# Altium project Final_Thesis.PrjPcb
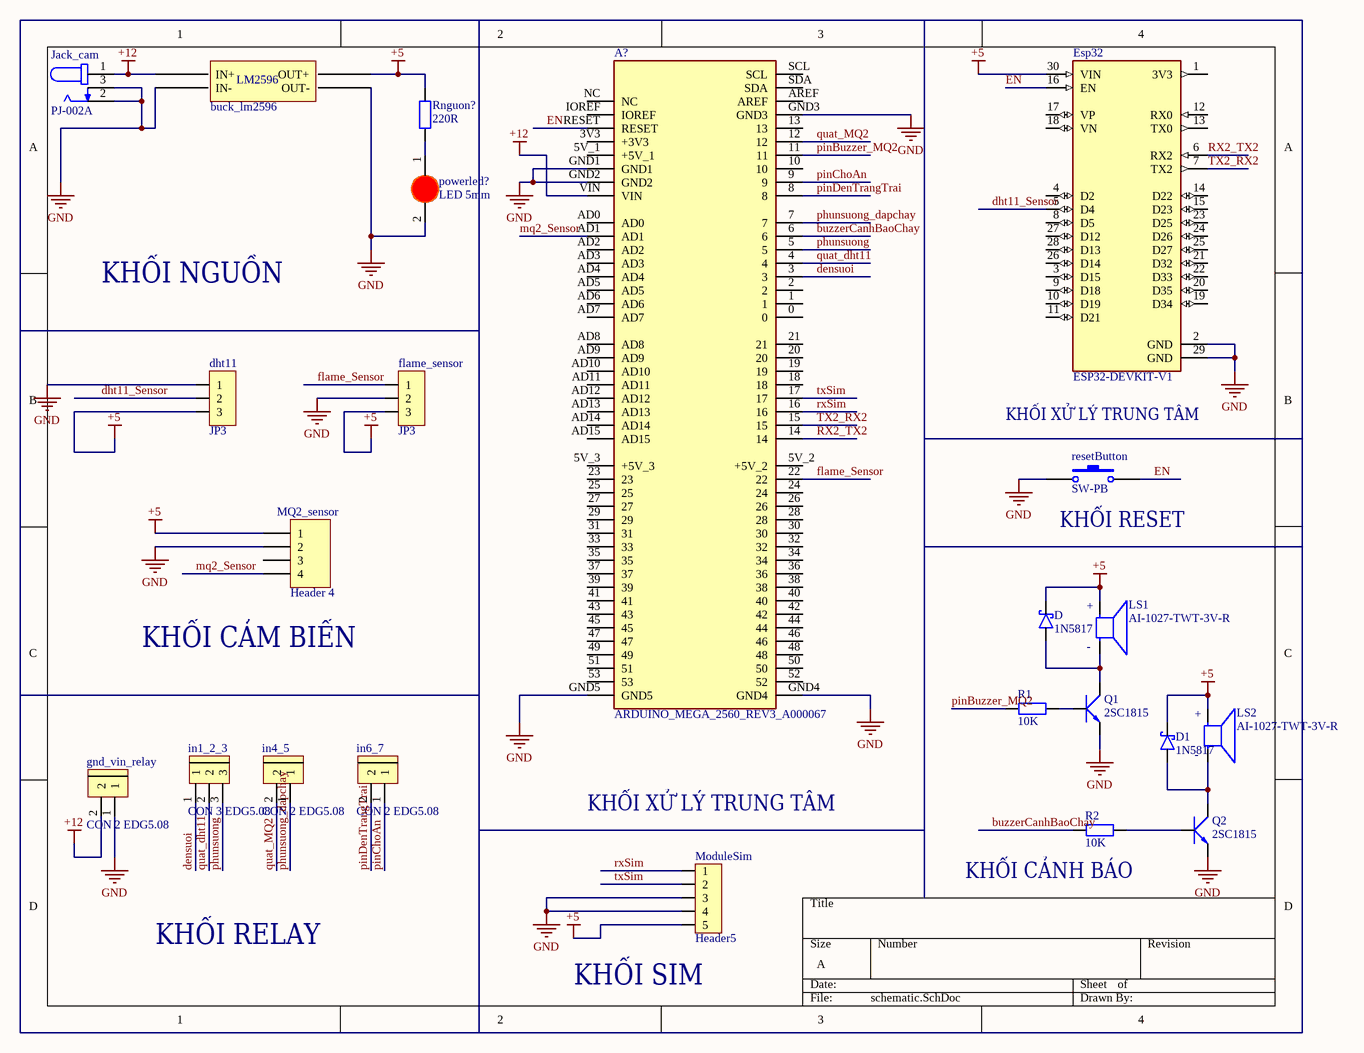
[diagram p0: schematic.SchDoc]
1 sheet, 23 parts. Net scope: global (net labels, ports and power ports of the same name join across sheets).
Board file: PCB_main.PcbDoc

## Sheet schematic.SchDoc
size A; SheetNumber: 1; SheetTotal: 1

### Parts
A?  ARDUINO_MEGA_2560_REV3_A000067  [ARDUINO_ARDUINO_MEGA_2560_REV3_A000067]
buck_lm2596  BUCK_LM2596  [BUCK_LM2596]  (value not drawn)
D  1N5817  [DO41-1]
D1  1N5817  [DO41-1]
dht11  JP3  [JP3-C1T]
Esp32  ESP32-DEVKIT-V1  [MODULE_ESP32_DEVKIT_V1]
flame_sensor  JP3  [JP3-C1T]
gnd_vin_relay  CON 2 EDG5.08  [CON 2 2EDG5.08]
in1_2_3  CON 3 EDG5.08  [CON 3 3EDG5.08]
in4_5  CON 2 EDG5.08  [CON 2 2EDG5.08]
in6_7  CON 2 EDG5.08  [CON 2 2EDG5.08]
Jack_cam  PJ-002A  [CUI_PJ-002A]
LS1  AI-1027-TWT-3V-R  [XDCR_AI-1027-TWT-3V-R]
LS2  AI-1027-TWT-3V-R  [XDCR_AI-1027-TWT-3V-R]
ModuleSim  Header5  [HDR5]
MQ2_sensor  Header 4  [HDR1X4]
powerled?  LED 5mm  [LED-5MM-RED]
Q1  2SC1815  [TO92-123]
Q2  2SC1815  [TO92-123]
R1  10K  [tro vach 1/4w]
R2  10K  [tro vach 1/4w]
resetButton  SW-PB  [SPST-2]
Rnguon?  220R  [tro vach 1/4w]

### Nets
+5: buck_lm2596.4(OUT+) D.C D1.C dht11.3 Esp32.30(VIN) flame_sensor.3 LS1.P LS2.P ModuleSim.5 MQ2_sensor.1 Rnguon?.2
+12: A?.VIN buck_lm2596.1(IN+) gnd_vin_relay.2 Jack_cam.1
GND: A?.GND1 A?.GND2 A?.GND3 A?.GND4 A?.GND5 buck_lm2596.2(IN-) buck_lm2596.3(OUT-) dht11.1 Esp32.2(GND) Esp32.29(GND) flame_sensor.2 gnd_vin_relay.1 Jack_cam.2 Jack_cam.3 ModuleSim.3 ModuleSim.4 MQ2_sensor.2 powerled?.2(K) Q1.1(E) Q2.1(E) resetButton.1
buzzerCanhBaoChay: A?.6 R2.1
densuoi: A?.3 in1_2_3.1
dht11_Sensor: dht11.2 Esp32.5(D4)
EN: A?.RESET Esp32.16(EN) resetButton.2
flame_Sensor: A?.22 flame_sensor.1
mq2_Sensor: A?.AD1 MQ2_sensor.4
phunsuong: A?.5 in1_2_3.3
phunsuong_dapchay: A?.7 in4_5.1
pinBuzzer_MQ2: A?.11 R1.1
pinChoAn: A?.9 in6_7.1
pinDenTrangTrai: A?.8 in6_7.2
quat_dht11: A?.4 in1_2_3.2
quat_MQ2: A?.12 in4_5.2
RX2_TX2: A?.14 Esp32.6(RX2)
rxSim: A?.16 ModuleSim.1
TX2_RX2: A?.15 Esp32.7(TX2)
txSim: A?.17 ModuleSim.2
NetD1_A: D1.A LS2.N Q2.2(C)
NetD_A: D.A LS1.N Q1.2(C)
Netpowerled?_1: powerled?.1(A) Rnguon?.1
NetQ1_3: Q1.3(B) R1.2
NetQ2_3: Q2.3(B) R2.2

Not connected (* = marked no-connect by the designer): A? 0 1 2 3V3(+3V3) 5V_1(+5V_1) 5V_2(+5V_2) 5V_3(+5V_3) 10 13 18 19 20 21 23 24 25 26 27 28 29 30 31 32 33 34 35 36 37 38 39 40 41 42 43 44 45 46 47 48 49 50 51 52 53 AD0 AD2 AD3 AD4 AD5 AD6 AD7 AD8 AD9 AD10 AD11 AD12 AD13 AD14 AD15 AREF IOREF NC SCL SDA; Esp32 1(3V3) 3(D15) 4(D2) 8(D5) 9(D18) 10(D19) 11(D21) 12(RX0) 13(TX0) 14(D22) 15(D23) 17(VP) 18(VN) 19(D34) 20(D35) 21(D32) 22(D33) 23(D25) 24(D26) 25(D27) 26(D14) 27(D12) 28(D13); MQ2_sensor 3

### Notes on the sheet
- KHỐI NGUỒN
- KHỐI XỬ LÝ TRUNG TÂM
- (near resetButton) KHỐI RESET
- (near MQ2_sensor) KHỐI CẢM BIẾN
- (near R2) KHỐI CẢNH BÁO
- KHỐI RELAY
- (near ModuleSim) KHỐI SIM
- (in symbol AI-1027-TWT-3V-R) +; -
- (in symbol BUCK_LM2596) LM2596

### Library data of the parts
A? = ARDUINO_MEGA_2560_REV3_A000067: ATmega2560 Arduino Mega2560 AVR® ATmega AVR MCU 8-Bit Embedded Evaluation Board; MP: ARDUINO MEGA 2560 REV3 | A000067; SnapEDA_Link: https://www.snapeda.com/parts/ARDUINO%20MEGA%202560%20REV3%20%7C%20A000067/Arduino/view-part/?ref=snap; Package: Non-Standard Arduino; Value: *; MF: Arduino; Check_prices: https://www.snapeda.com/parts/ARDUINO%20MEGA%202560%20REV3%20%7C%20A000067/Arduino/view-part/?ref=eda
D D1 = 1N5817: 5A SCHOTTKY RECTIFIER; MF: STMicroelectronics; Value: *; SnapEDA_Link: https://www.snapeda.com/parts/1N5817/STMicroelectronics/view-part/2770372/?ref=snap; Price: None; Availability: Unavailable; Package: DO-41 STMicroelectronics; MP: 1N5817
dht11 flame_sensor = JP3: WR-PHD 2.54 mm Angled Socket Header; Manufacturer: W¨¹rth Elektronik eiSos GmbH; partNo: 613003143121; ComponentLink1 Description: Manufacturer; ComponentLink2 Description: Datasheet; NoPins: 03; Created Date: 29 March 2013; ComponentLink1URL: http://www.we-online.com; ComponentLink2URL: http://katalog.we-online.de/em/datasheet/6130xx143121.pdf; Created by: Karrer Zheng
Esp32 = ESP32-DEVKIT-V1: Dual core, Wi-Fi: 2.4 GHz up to 150 Mbits/s,BLE (Bluetooth Low Energy) and legacy Bluetooth, 32 bits, Up to 240 MHz; MF: Do it; Price: None; Availability: Not in stock; Package: None; MP: ESP32-DEVKIT-V1; Value: *; SnapEDA_Link: https://www.snapeda.com/parts/ESP32-DEVKIT-V1/Do+it/view-part/?ref=snap; Check_prices: https://www.snapeda.com/parts/ESP32-DEVKIT-V1/Do+it/view-part/?ref=eda
gnd_vin_relay in4_5 in6_7 = CON 2 EDG5.08: Cắm; Ten_Linh_Kien: CON 2 2EDG5.08-2P 5.08MM ( Xanh Cong); Ma_Hang: MH000759; Ghi_Chu: *; Don_Vi: Con; Kieu_Chan: *; Chung_Loai: Cắm
in1_2_3 = CON 3 EDG5.08: Cắm; Ten_Linh_Kien: CON 3 2EDG5.08-3P 5.08MM ( Xanh Cong); Ma_Hang: MH000760; Ghi_Chu: *; Kieu_Chan: *; Don_Vi: Con; Chung_Loai: Cắm
Jack_cam = PJ-002A: 2.0 x 6.5 mm, 2.5 A, Horizontal, Through Hole, Dc Power Jack Connector; MF: CUI Devices; MP: PJ-002A; Check_prices: https://www.snapeda.com/parts/PJ-002A/CUI+Devices/view-part/?ref=eda; Availability: In Stock; CUI_purchase_URL: https://www.cuidevices.com/product/interconnect/connectors/dc-power-connectors/jacks/pj-002a?utm_source=snapeda.com&utm_medium=referral&utm_campaign=snapedaBOM; SnapEDA_Link: https://www.snapeda.com/parts/PJ-002A/CUI+Devices/view-part/?ref=snap; Purchase-URL: https://pricing.snapeda.com/search/part/PJ-002A/?ref=eda; Price: None; Package: None; Value: *
LS1 LS2 = AI-1027-TWT-3V-R: AUDIO INDICATOR 3VDC 30MA 80DBA 2700HZ; MF: PUI Audio; SnapEDA_Link: https://www.snapeda.com/parts/AI-1027-TWT-3V-R/PUI+Audio%252C+Inc./view-part/?ref=snap; Package: None; Value: *; MP: AI-1027-TWT-3V-R; Check_prices: https://www.snapeda.com/parts/AI-1027-TWT-3V-R/PUI+Audio%252C+Inc./view-part/?ref=eda
ModuleSim = Header5: Header IDC, 5 x 1 Pin Vertical 2.54mm Pitch (Non-Boxed, Male); Manufacturer: W¨¹rth Elektronik eiSos GmbH; partNo: 613002143121; ComponentLink1 Description: Manufacturer; ComponentLink2 Description: Datasheet; NoPins: 02; Created Date: 29 March 2013; ComponentLink1URL: http://www.we-online.com; ComponentLink2URL: http://katalog.we-online.de/em/datasheet/6130xx143121.pdf; Created by: Karrer Zheng
MQ2_sensor = Header 4: Header, 4-Pin; LatestRevisionDate: 17-Jul-2002; LatestRevisionNote: Re-released for DXP Platform.; Publisher: Altium Limited
powerled? = LED 5mm Do: Cắm; Don_Vi: Con; Ma_Hang: MH008967; Ten_Linh_Kien: Led 5MM Phủ Đỏ (1000c); Ghi_Chu: *; Kieu_Chan: *; Chung_Loai: Cắm
Q1 Q2 = 2SC1815: NPN 600mW, ECB; Value: C1815
R1 R2 Rnguon? = Tro Vach 1/4W 5% 220R: Cắm; Don_Vi: Con; So_Chan: 2; Ten_Linh_Kien: Trở Vạch 1/4w 5% 220R; Ma_Hang: MH007300; Chung_Loai: Cắm; Kieu_Chan: *
resetButton = SW-PB: Switch; Published: 24-Mar-1999; LatestRevisionDate: 17-Jul-2002; LatestRevisionNote: Re-released for DXP Platform.; PackageReference: SPST-2; Publisher: Altium Limited; PackageDescription: Switch; 2 Leads